# Altium schematic sheet Proc.SchDoc
size Tabloid
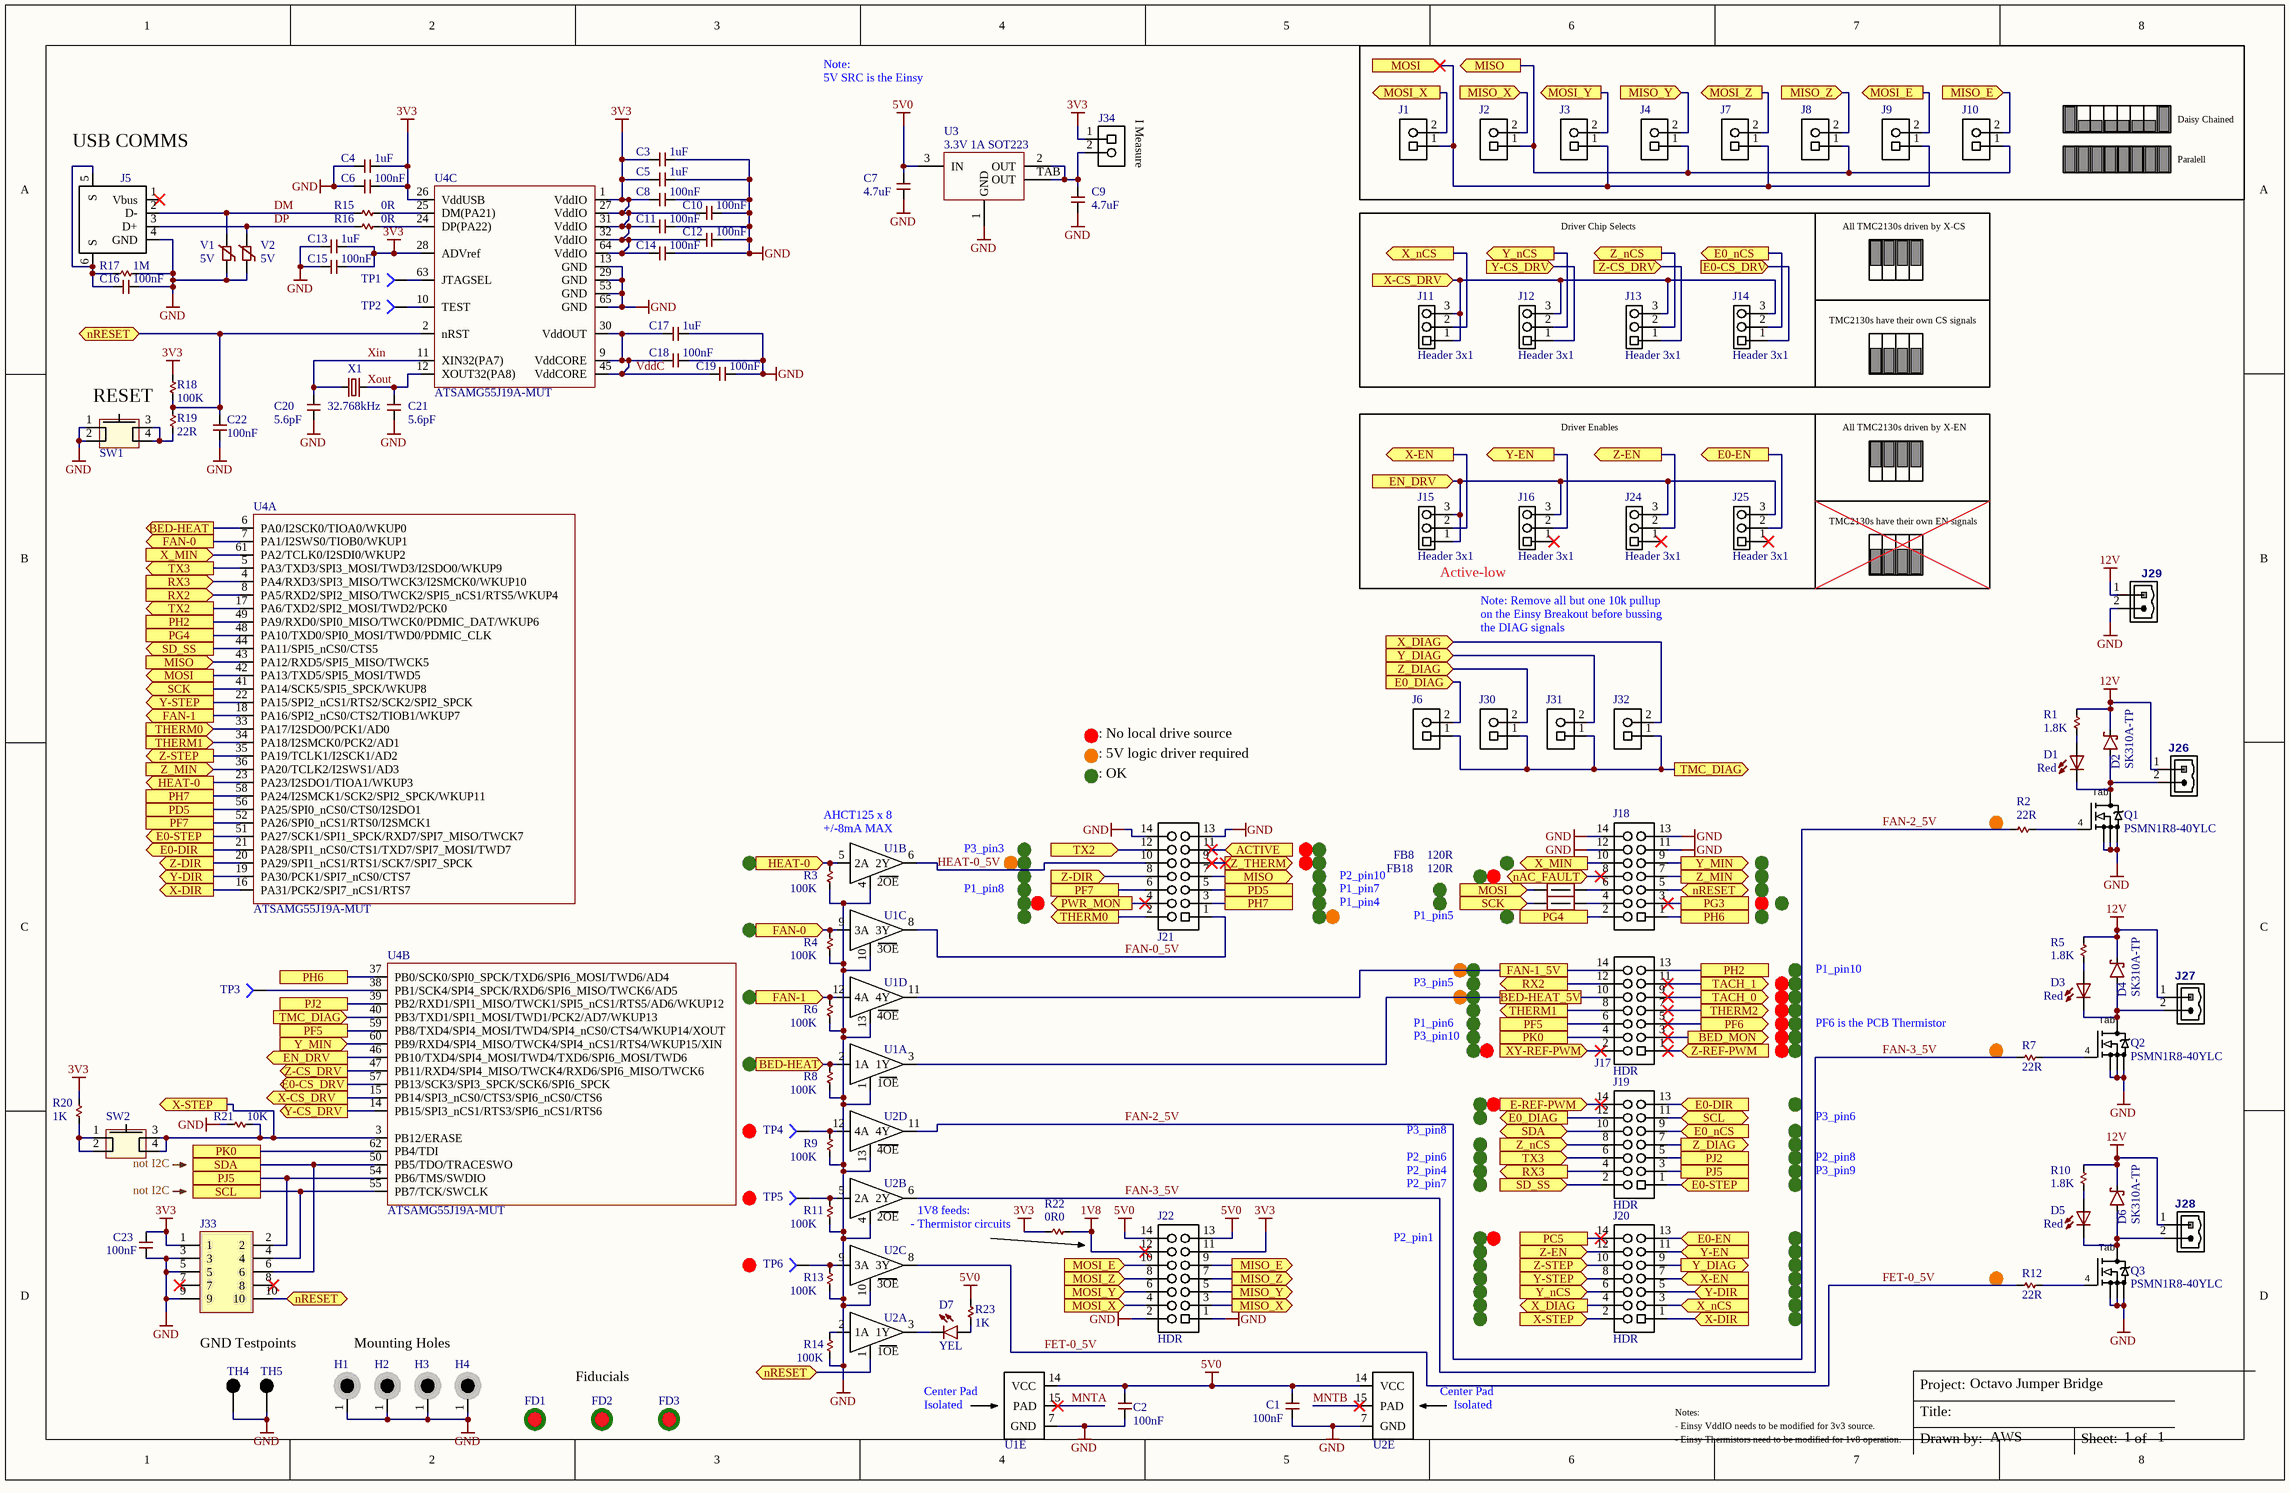
[diagram p0: Proc.SchDoc]

## Parts
C1  100nF  [C0603]
C2  100nF  [C0603]
C3  1uF  [C0402]
C4  1uF  [C0402]
C5  1uF  [C0402]
C6  100nF  [C0402]
C7  value 4.7uF  [C0603]  (hidden comment: 4.7uF 6.3V 0603)
C8  100nF  [C0402]
C9  value 4.7uF  [C0603]  (hidden comment: 4.7uF 6.3V 0603)
C10  100nF  [C0402]
C11  100nF  [C0402]
C12  100nF  [C0402]
C13  1uF  [C0402]
C14  100nF  [C0402]
C15  100nF  [C0402]
C16  100nF  [C0402]
C17  1uF  [C0402]
C18  100nF  [C0402]
C19  100nF  [C0402]
C20  5.6pF  [C0402]
C21  5.6pF  [C0402]
C22  100nF  [C0402]
C23  100nF  [C0402]
D1  Red  [LED2012120]
D2  SK310A-TP  [SMA-SM]
D3  Red  [LED2012120]
D4  SK310A-TP  [SMA-SM]
D5  Red  [LED2012120]
D6  SK310A-TP  [SMA-SM]
D7  YEL  [LED2012120]
FB8  120R  [R0402]
FB18  120R  [R0402]
FD1  FIDUCIAL  [FIDUCIAL-1X2]  (value not drawn)
FD2  FIDUCIAL  [FIDUCIAL-1X2]  (value not drawn)
FD3  FIDUCIAL  [FIDUCIAL-1X2]  (value not drawn)
H1  Hole_DS  [Wave_hole_3x7-doubleSided]  (value not drawn)  (no BOM)
H2  Hole_DS  [Wave_hole_3x7-doubleSided]  (value not drawn)  (no BOM)
H3  Hole_DS  [Wave_hole_3x7-doubleSided]  (value not drawn)  (no BOM)
H4  Hole_DS  [Wave_hole_3x7-doubleSided]  (value not drawn)  (no BOM)
J1  Header 2x1  [HDR2X1]  (value not drawn)
J2  Header 2x1  [HDR2X1]  (value not drawn)
J3  Header 2x1  [HDR2X1]  (value not drawn)
J4  Header 2x1  [HDR2X1]  (value not drawn)
J5  USB-B TH R/A  [PN61729_ALT]  (value not drawn)
J6  Header 2x1  [HDR2X1]  (value not drawn)
J7  Header 2x1  [HDR2X1]  (value not drawn)
J8  Header 2x1  [HDR2X1]  (value not drawn)
J9  Header 2x1  [HDR2X1]  (value not drawn)
J10  Header 2x1  [HDR2X1]  (value not drawn)
J11  Header 3x1  [HDR3X1]
J12  Header 3x1  [HDR3X1]
J13  Header 3x1  [HDR3X1]
J14  Header 3x1  [HDR3X1]
J15  Header 3x1  [HDR3X1]
J16  Header 3x1  [HDR3X1]
J17  HDR  [HDR2X7_ALT_PINOUT]
J18  HDR  [HDR2X7_ALT_PINOUT]  (value not drawn)
J19  HDR  [HDR2X7_ALT_PINOUT]
J20  HDR  [HDR2X7_ALT_PINOUT]
J21  HDR  [HDR2X7_ALT_PINOUT]  (value not drawn)
J22  HDR  [HDR2X7_ALT_PINOUT]
J24  Header 3x1  [HDR3X1]
J25  Header 3x1  [HDR3X1]
J26  0395311002  [MSTBV2]  (value not drawn)
J27  0395311002  [MSTBV2]  (value not drawn)
J28  0395311002  [MSTBV2]  (value not drawn)
J29  0395311002  [MSTBV2]  (value not drawn)
J30  Header 2x1  [HDR2X1]  (value not drawn)
J31  Header 2x1  [HDR2X1]  (value not drawn)
J32  Header 2x1  [HDR2X1]  (value not drawn)
J33  0.05in 2-Row  [FTSH-105-XX-X-DV]  (value not drawn)
J34  Header 2x1  [HDR2X1]  (value not drawn)
Q1  PSMN1R8-40YLC  [SOT669]
Q2  PSMN1R8-40YLC  [SOT669]
Q3  PSMN1R8-40YLC  [SOT669]
R1  1.8K  [R0603]
R2  22R  [R0805]
R3  100K  [R0402]
R4  100K  [R0402]
R5  1.8K  [R0603]
R6  100K  [R0402]
R7  22R  [R0805]
R8  100K  [R0402]
R9  100K  [R0402]
R10  1.8K  [R0603]
R11  100K  [R0402]
R12  22R  [R0805]
R13  100K  [R0402]
R14  100K  [R0402]
R15  0R  [R0402]
R16  0R  [R0402]
R17  1M  [R0402]
R18  100K  [R0402]
R19  22R  [R0805]
R20  1K  [R0402]
R21  10K  [R0402]
R22  0R0  [R0805]
R23  1K  [R0402]
SW1  KMR741NG ULC LFS  [KMR 6 Series]  (value not drawn)
SW2  KMR741NG ULC LFS  [KMR 6 Series]  (value not drawn)
TH4  TH  [TP_80_150]  (value not drawn)  (no BOM)
TH5  TH  [TP_80_150]  (value not drawn)  (no BOM)
TP1  NOTAPART-Testpoint  [TP-2]  (value not drawn)  (no BOM)
TP2  NOTAPART-Testpoint  [TP-2]  (value not drawn)  (no BOM)
TP3  NOTAPART-Testpoint  [TP-2]  (value not drawn)  (no BOM)
TP4  NOTAPART-Testpoint  [TP-2]  (value not drawn)  (no BOM)
TP5  NOTAPART-Testpoint  [TP-2]  (value not drawn)  (no BOM)
TP6  NOTAPART-Testpoint  [TP-2]  (value not drawn)  (no BOM)
U1  SN74AHCT125RGYR  [QFN50P350X350X100_RGY_S-PVQFN-N14]  (value not drawn)  (parts A,B,C,D,E of 5)
U2  SN74AHCT125RGYR  [QFN50P350X350X100_RGY_S-PVQFN-N14]  (value not drawn)  (parts A,B,C,D,E of 5)
U3  3.3V 1A SOT223  [SOT223_AZ1117]
U4  ATSAMG55J19A-MUT  [QFN64_7.5x7.5mm]  (parts A,B,C of 3)
V1  5V  [R0603]
V2  5V  [R0603]
X1  32.768kHz  [XTAL_32X15_2]

## Blocks framed on the sheet
Active-low: J15 J16 J24 J25

## Ports
ACTIVE (in), BED-HEAT (in), BED-HEAT (out), BED-HEAT_5V, BED_MON (out), E0-CS_DRV (in), E0-CS_DRV (out), E0-DIR (in), E0-DIR (out), E0-EN (in), E0-EN (out), E0-STEP (in), E0-STEP (out), E0_DIAG (in), E0_DIAG (out), E0_nCS (in), E0_nCS (out), E-REF-PWM (in), EN_DRV (in), EN_DRV (out), FAN-0 (in), FAN-0 (out), FAN-1 (in), FAN-1 (out), FAN-1_5V, HEAT-0 (in), HEAT-0 (out), MISO (in), MISO (out), MISO_E (in), MISO_E (out), MISO_X (in), MISO_X (out), MISO_Y (in), MISO_Y (out), MISO_Z (in), MISO_Z (out), MOSI (in), MOSI (out), MOSI_E (in), MOSI_E (out), MOSI_X (in), MOSI_X (out), MOSI_Y (in), MOSI_Y (out), MOSI_Z (in), MOSI_Z (out), nAC_FAULT (bidir), nRESET (bidir), PC5, PD5, PF5, PF6 (out), PF7, PG3, PG4, PH2, PH6, PH7, PJ2, PJ5, PK0, PWR_MON (out), RX2 (in), RX2 (out), RX3 (in), RX3 (out), SCK (in), SCK (out), SCL, SCL (bidir), SD_SS (in), SD_SS (out), SDA, SDA (bidir), TACH_0 (out), TACH_1 (out), THERM0 (in), THERM0 (out), THERM1 (in), THERM1 (out), THERM2 (out), TMC_DIAG (in), TMC_DIAG (out), TX2 (in), TX2 (out), TX3 (in), TX3 (out), X-CS_DRV (in), X-CS_DRV (out), X-DIR (in), X-DIR (out), X-EN (in), X-EN (out), X-STEP (in), X-STEP (out), X_DIAG (in), X_DIAG (out), X_MIN (in), X_MIN (out), X_nCS (in), X_nCS (out), XY-REF-PWM (in), Y-CS_DRV (in), Y-CS_DRV (out), Y-DIR (in), Y-DIR (out), Y-EN (in), Y-EN (out), Y-STEP (in), Y-STEP (out), Y_DIAG (in), Y_DIAG (out), Y_MIN (in), Y_MIN (out), Y_nCS (in), Y_nCS (out), Z-CS_DRV (in), Z-CS_DRV (out), Z-DIR (in), Z-DIR (out), Z-EN (in), Z-EN (out), Z-REF-PWM (in), Z-STEP (in), Z-STEP (out), Z_DIAG (in), Z_DIAG (out), Z_MIN (in), Z_MIN (out), Z_nCS (in), Z_nCS (out), Z_THERM (out)

## Nets
1V8: J22.12 R22.2
3V3: C3.2 C4.1 C5.2 C6.2 C8.1 C10.1 C11.1 C12.1 C13.1 C14.1 C15.2 C23.1 J22.11 J33.1 J34.1 R18.2 R20.2 R22.1 U4.1(VddIO) U4.26(VddUSB) U4.27(VddIO) U4.28(ADVref) U4.31(VddIO) U4.32(VddIO) U4.64(VddIO)
5V0: C1.2 C2.2 C7.2 J22.13 J22.14 R23.1 U1.14(VCC) U2.14(VCC) U3.3(IN)
12V: D2.K D4.K D6.K J26.1 J27.1 J28.1 J29.1 R1.2 R5.2 R10.2
GND: C1.1 C2.1 C3.1 C4.2 C5.1 C6.1 C7.1 C8.2 C9.1 C10.2 C11.2 C12.2 C13.2 C14.2 C15.1 C16.1 C17.1 C18.2 C19.2 C20.1 C21.1 C22.1 C23.2 H1.1 H2.1 H3.1 H4.1 J5.4(GND) J18.11 J18.12 J18.13 J18.14 J21.13 J21.14 J22.1 J22.2 J29.2 J33.3 J33.5 J33.9 Q1.1(S) Q1.2(S) Q1.3(S) Q2.1(S) Q2.2(S) Q2.3(S) Q3.1(S) Q3.2(S) Q3.3(S) R3.2 R4.2 R6.2 R8.2 R9.2 R11.2 R13.2 R14.2 R17.1 R21.2 SW1.1 SW1.2 TH4.1 TH5.1 U1.1(1OE) U1.4(2OE) U1.7(GND) U1.10(3OE) U1.13(4OE) U2.4(2OE) U2.7(GND) U2.10(3OE) U2.13(4OE) U3.1(GND) U4.13(GND) U4.29(GND) U4.53(GND) U4.65(GND) V1.2 V2.2
ACTIVE: J21.11 ; port ACTIVE
BED-HEAT: R8.1 U1.2(1A) U4.6(PA0/I2SCK0/TIOA0/WKUP0) ; port BED-HEAT
BED-HEAT_5V: J17.10 U1.3(1Y) ; port BED-HEAT_5V
BED_MON: J17.3 ; port BED_MON
DM: J5.2(D-) R15.1 V1.1
DP: J5.3(D+) R16.1 V2.1
E0-CS_DRV: J14.1 U4.57(PB13/SCK3/SPI3_SPCK/SCK6/SPI6_SPCK) ; port E0-CS_DRV
E0-DIR: J19.13 U4.21(PA28/SPI1_nCS0/CTS1/TXD7/SPI7_MOSI/TWD7) ; port E0-DIR
E0-EN: J20.13 J25.2 ; port E0-EN
E0-STEP: J19.1 U4.51(PA27/SCK1/SPI1_SPCK/RXD7/SPI7_MISO/TWCK7) ; port E0-STEP
E0_DIAG: J6.2 J19.12 ; port E0_DIAG
E0_nCS: J14.2 J19.9 ; port E0_nCS
E-REF-PWM: J19.14 ; port E-REF-PWM
EN_DRV: J15.1 J15.3 J16.3 J24.3 J25.3 U4.46(PB10/TXD4/SPI4_MOSI/TWD4/TXD6/SPI6_MOSI/TWD6) ; port EN_DRV
FAN-0: R4.1 U1.9(3A) U4.7(PA1/I2SWS0/TIOB0/WKUP1) ; port FAN-0
FAN-0_5V: J21.1 U1.8(3Y)
FAN-1: R6.1 U1.12(4A) U4.18(PA16/SPI2_nCS0/CTS2/TIOB1/WKUP7) ; port FAN-1
FAN-1_5V: J17.14 U1.11(4Y) ; port FAN-1_5V
FAN-2_5V: R2.1 U2.11(4Y)
FAN-3_5V: R7.1 U2.6(2Y)
FET-0_5V: R12.1 U2.8(3Y)
HEAT-0: R3.1 U1.5(2A) U4.23(PA23/I2SDO1/TIOA1/WKUP3) ; port HEAT-0
HEAT-0_5V: J21.10 U1.6(2Y)
MISO: J2.1 J4.1 J8.1 J10.1 J21.7 U4.43(PA12/RXD5/SPI5_MISO/TWCK5) ; port MISO
MISO_E: J10.2 J22.9 ; port MISO_E
MISO_X: J2.2 J22.3 ; port MISO_X
MISO_Y: J4.2 J22.5 ; port MISO_Y
MISO_Z: J8.2 J22.7 ; port MISO_Z
MNTA: U1.15(PAD)
MNTB: U2.15(PAD)
MOSI: FB8.2 J1.1 J3.1 J7.1 J9.1 U4.42(PA13/TXD5/SPI5_MOSI/TWD5) ; port MOSI
MOSI_E: J9.2 J22.10 ; port MOSI_E
MOSI_X: J1.2 J22.4 ; port MOSI_X
MOSI_Y: J3.2 J22.6 ; port MOSI_Y
MOSI_Z: J7.2 J22.8 ; port MOSI_Z
nAC_FAULT: J18.8 ; port nAC_FAULT
nRESET: C22.2 J18.5 J33.10 R18.1 R19.2 U2.1(1OE) U4.2(nRST) ; port nRESET
PC5: J20.14 ; port PC5
PD5: J21.5 U4.56(PA25/SPI0_nCS0/CTS0/I2SDO1) ; port PD5
PF5: J17.6 U4.59(PB8/TXD4/SPI4_MOSI/TWD4/SPI4_nCS0/CTS4/WKUP14/XOUT) ; port PF5
PF6: J17.5 ; port PF6
PF7: J21.6 U4.52(PA26/SPI0_nCS1/RTS0/I2SMCK1) ; port PF7
PG3: J18.3 ; port PG3
PG4: J18.2 U4.48(PA10/TXD0/SPI0_MOSI/TWD0/PDMIC_CLK) ; port PG4
PH2: J17.13 U4.49(PA9/RXD0/SPI0_MISO/TWCK0/PDMIC_DAT/WKUP6) ; port PH2
PH6: J18.1 U4.37(PB0/SCK0/SPI0_SPCK/TXD6/SPI6_MOSI/TWD6/AD4) ; port PH6
PH7: J21.3 U4.58(PA24/I2SMCK1/SCK2/SPI2_SPCK/WKUP11) ; port PH7
PJ2: J19.5 U4.39(PB2/RXD1/SPI1_MISO/TWCK1/SPI5_nCS1/RTS5/AD6/WKUP12) ; port PJ2
PJ5: J19.3 J33.2 U4.54(PB6/TMS/SWDIO) ; port PJ5
PK0: J17.4 U4.62(PB4/TDI) ; port PK0
PWR_MON: J21.4 ; port PWR_MON
RX2: J17.12 U4.8(PA5/RXD2/SPI2_MISO/TWCK2/SPI5_nCS1/RTS5/WKUP4) ; port RX2
RX3: J19.4 U4.4(PA4/RXD3/SPI3_MISO/TWCK3/I2SMCK0/WKUP10) ; port RX3
SCK: FB18.2 U4.41(PA14/SCK5/SPI5_SPCK/WKUP8) ; port SCK
SCL: J19.11 J33.4 U4.55(PB7/TCK/SWCLK) ; port SCL
SD_SS: J19.2 U4.44(PA11/SPI5_nCS0/CTS5) ; port SD_SS
SDA: J19.10 J33.6 U4.50(PB5/TDO/TRACESWO) ; port SDA
TACH_0: J17.9 ; port TACH_0
TACH_1: J17.11 ; port TACH_1
THERM0: J21.2 U4.33(PA17/I2SDO0/PCK1/AD0) ; port THERM0
THERM1: J17.8 U4.34(PA18/I2SMCK0/PCK2/AD1) ; port THERM1
THERM2: J17.7 ; port THERM2
TMC_DIAG: J6.1 J30.1 J31.1 J32.1 U4.40(PB3/TXD1/SPI1_MOSI/TWD1/PCK2/AD7/WKUP13) ; port TMC_DIAG
TX2: J21.12 U4.17(PA6/TXD2/SPI2_MOSI/TWD2/PCK0) ; port TX2
TX3: J19.6 U4.5(PA3/TXD3/SPI3_MOSI/TWD3/I2SDO0/WKUP9) ; port TX3
VddC: C17.2 C18.1 C19.1 U4.9(VddCORE) U4.30(VddOUT) U4.45(VddCORE)
X-CS_DRV: J11.1 J11.3 J12.3 J13.3 J14.3 U4.15(PB14/SPI3_nCS0/CTS3/SPI6_nCS0/CTS6) ; port X-CS_DRV
X-DIR: J20.1 U4.16(PA31/PCK2/SPI7_nCS1/RTS7) ; port X-DIR
X-EN: J15.2 J20.7 ; port X-EN
X-STEP: J20.2 R21.1 SW2.3 SW2.4 U4.3(PB12/ERASE) ; port X-STEP
X_DIAG: J20.4 J32.2 ; port X_DIAG
X_MIN: J18.10 U4.61(PA2/TCLK0/I2SDI0/WKUP2) ; port X_MIN
X_nCS: J11.2 J20.3 ; port X_nCS
Xin: C20.2 U4.11(XIN32(PA7)) X1.1(C1)
Xout: C21.2 U4.12(XOUT32(PA8)) X1.2(C2)
XY-REF-PWM: J17.2 ; port XY-REF-PWM
Y-CS_DRV: J12.1 U4.14(PB15/SPI3_nCS1/RTS3/SPI6_nCS1/RTS6) ; port Y-CS_DRV
Y-DIR: J20.5 U4.19(PA30/PCK1/SPI7_nCS0/CTS7) ; port Y-DIR
Y-EN: J16.2 J20.11 ; port Y-EN
Y-STEP: J20.8 U4.22(PA15/SPI2_nCS1/RTS2/SCK2/SPI2_SPCK) ; port Y-STEP
Y_DIAG: J20.9 J31.2 ; port Y_DIAG
Y_MIN: J18.9 U4.60(PB9/RXD4/SPI4_MISO/TWCK4/SPI4_nCS1/RTS4/WKUP15/XIN) ; port Y_MIN
Y_nCS: J12.2 J20.6 ; port Y_nCS
Z-CS_DRV: J13.1 U4.47(PB11/RXD4/SPI4_MISO/TWCK4/RXD6/SPI6_MISO/TWCK6) ; port Z-CS_DRV
Z-DIR: J21.8 U4.20(PA29/SPI1_nCS1/RTS1/SCK7/SPI7_SPCK) ; port Z-DIR
Z-EN: J20.12 J24.2 ; port Z-EN
Z-REF-PWM: J17.1 ; port Z-REF-PWM
Z-STEP: J20.10 U4.35(PA19/TCLK1/I2SCK1/AD2) ; port Z-STEP
Z_DIAG: J19.7 J30.2 ; port Z_DIAG
Z_MIN: J18.7 U4.36(PA20/TCLK2/I2SWS1/AD3) ; port Z_MIN
Z_nCS: J13.2 J19.8 ; port Z_nCS
Z_THERM: J21.9 ; port Z_THERM
NetC9_2: C9.2 J34.2 U3.2(OUT) U3.TAB(OUT)
NetC16_2: C16.2 J5.5(S) J5.6(S) R17.2
NetD1_A: D1.A R1.1
NetD1_C: D1.C D2.A J26.2 Q1.TAB(D)
NetD3_A: D3.A R5.1
NetD3_C: D3.C D4.A J27.2 Q2.TAB(D)
NetD5_A: D5.A R10.1
NetD5_C: D5.C D6.A J28.2 Q3.TAB(D)
NetD7_A: D7.A R23.2
NetD7_C: D7.C U2.3(1Y)
NetFB8_1: FB8.1 J18.6
NetFB18_1: FB18.1 J18.4
NetQ1_4: Q1.4(G) R2.2
NetQ2_4: Q2.4(G) R7.2
NetQ3_4: Q3.4(G) R12.2
NetR9_1: R9.1 TP4.1 U2.12(4A)
NetR11_1: R11.1 TP5.1 U2.5(2A)
NetR13_1: R13.1 TP6.1 U2.9(3A)
NetR14_1: R14.1 U2.2(1A)
NetR15_2: R15.2 U4.25(DM(PA21))
NetR16_2: R16.2 U4.24(DP(PA22))
NetR19_1: R19.1 SW1.3 SW1.4
NetR20_1: R20.1 SW2.1 SW2.2
NetTP1_1: TP1.1 U4.63(JTAGSEL)
NetTP2_1: TP2.1 U4.10(TEST)
NetTP3_1: TP3.1 U4.38(PB1/SCK4/SPI4_SPCK/RXD6/SPI6_MISO/TWCK6/AD5)

Not connected (* = marked no-connect by the designer): J5 1(Vbus)*; J16 1*; J24 1*; J25 1*; J33 7* 8*

## Notes on the sheet
- 5V SRC is the Einsy
- Note:
- (near J5) USB COMMS
- (near J34) I Measure
- Paralell
- Daisy Chained
- Driver Chip Selects
- All TMC2130s driven by X-CS
- TMC2130s have their own CS signals
- RESET
- Driver Enables
- All TMC2130s driven by X-EN
- TMC2130s have their own EN signals
- Note: Remove all but one 10k pullup
- on the Einsy Breakout before bussing
- the DIAG signals
- : 5V logic driver required
- : No local drive source
- +/-8mA MAX
- AHCT125 x 8
- : OK
- P3_pin3
- P1_pin8
- P2_pin10
- P1_pin7
- P1_pin4
- P1_pin5
- P1_pin10
- P1_pin6
- P3_pin5
- PF6 is the PCB Thermistor
- P3_pin10
- (near SW2) not I2C
- P3_pin8
- P2_pin6
- P3_pin6
- P2_pin8
- not I2C
- - Thermistor circuits
- (near U2) 1V8 feeds:
- P2_pin1
- P2_pin4
- P2_pin7
- P3_pin9
- GND Testpoints
- Mounting Holes
- Fiducials
- Center Pad
- Isolated
- Notes:
- - Einsy VddIO needs to be modified for 3v3 source.
- Octavo Jumper Bridge
- - Einsy Thermistors need to be modified for 1v8 operation.
- AWS
- 1
- Title:
- Project:
- Drawn by:
- Sheet:
- of
- (in symbol PSMN1R8-40YLC) Tab

## Library data of the parts
C1 C2 = 100nF 0603 50V X7R: CAP CER 0603 100nF 50V 10% X7R; MANUFACTURER: Kemet; MANUFACTURER #: C0603C104K5RACTU; PART: 100nF 50V X7R 0603; PART DESCRIPTION: 0.10µF ±10% 50V Ceramic Capacitor X7R 0603 (1608 Metric); DISTRIBUTOR #: 399-5089-2-ND; DISTRIBUTOR: Digikey; TOLERANCE: 10%; EE_SPEC: 50V; VALUE: 100nF
C3-C5 C13 C17 = 1uF 0402 6.3V X5R: CAP CER 0402 1uF 6.3V 10% X5R; MANUFACTURER: Murata; MANUFACTURER #: GRM155R60J105KE19D; PART: 1uF 6.3V X5R 0402; PART DESCRIPTION: 1µF ±10% 6.3V Ceramic Capacitor X5R 0402 (1005 Metric); DISTRIBUTOR #: 490-1320-2-ND; DISTRIBUTOR: Digikey; TOLERANCE: 10%; EE_SPEC: 6.3V; VALUE: 1uF
C6 C8 C10-C12 C14-C16 C18 C19 C22 C23 = 100nF 0402 16V X7R: CAP CER 0402 100nF 16V 10% X7R; MANUFACTURER: Murata; MANUFACTURER #: GRM155R71C104KA88D; PART: 0.1uF 16V X7R 0402; PART DESCRIPTION: 0.10µF ±10% 16V Ceramic Capacitor X7R 0402 (1005 Metric); VALUE: 100nF; DISTRIBUTOR #: 490-3261-2-ND; DISTRIBUTOR: Digikey; TOLERANCE: 10%; EE_SPEC: 16V
C7 C9 = 4.7uF 0603 6.3V X7R: CAP CER 4.7UF 6.3V X7R 0603; MANUFACTURER: Samsung; MANUFACTURER #: CL10B475KQ8NQNC; PART DESCRIPTION: 4.7µF ±10% 6.3V Ceramic Capacitor X7R 0603 (1608 Metric); TOLERANCE: 10%; DISTRIBUTOR #: 1276-2087-2-ND; DISTRIBUTOR: Digikey; PART: 4.7uF; EE_SPEC: 6.3V
C20 C21 = 5.6pF 50V 0402 C0G: CAP CER 5.6PF 50V C0G/NP0 0402; MANUFACTURER: Murata; MANUFACTURER #: GRM1555C1H5R6CA01D; PART DESCRIPTION: 5.6pF ±0.25pF 50V Ceramic Capacitor C0G, NP0 0402 (1005 Metric); TOLERANCE: +/-0.25pF; DISTRIBUTOR #: 490-6250-2-ND; DISTRIBUTOR: Digikey; PART: 5.6pF 50V 0402 C0G; EE_SPEC: 50V; VALUE: 5.6pF
D1 D3 D5 = 5988110107F: LED 0805 Red; MANUFACTURER: Dialight; PART: LED Red 0805; PART DESCRIPTION: Red 635nm LED Indication - Discrete 2.2V 0805 (2012 Metric); TOLERANCE: -NA-; EE_SPEC: Vf=2.2V; VALUE: Red; MANUFACTURER #: 5988110107F; DISTRIBUTOR #: 350-2038-2-ND; DISTRIBUTOR: Digikey
D2 D4 D6 = SK310A: DIODE Schottky 3A SMA; MANUFACTURER: MCC; PART: Schottky Diode 100V 3A; PART DESCRIPTION: Diode Schottky 100V 3A Surface Mount DO-214AC (HSMA); TOLERANCE: -NA-; VALUE: -NA-; EE_SPEC: 100V 3A; MANUFACTURER #: SK310A; DISTRIBUTOR #: SK310A-TPTR-ND; DISTRIBUTOR: Digikey
D7 = 5988140107F: LED 0805 Yellow; MANUFACTURER: Dialight; PART: LED Yellow 0805; PART DESCRIPTION: Yellow 593nm LED Indication - Discrete 2V 0805 (2012 Metric); TOLERANCE: -NA-; EE_SPEC: Vf=2V; VALUE: YEL; MANUFACTURER #: 5988140107F; DISTRIBUTOR #: 350-2041-2-ND; DISTRIBUTOR: Digikey
FB8 FB18 = FERRITE 120R 1A 0402: FERRITE BEAD 120 OHM 0402 1LN; MANUFACTURER: Taiyo Yuden; MANUFACTURER #: BKP1005HS121-T; VALUE: 120Rfb; TOLERANCE: -NA-; EE_SPEC: 1A; DISTRIBUTOR #: 587-1921-2-ND; DISTRIBUTOR: Digikey; PART: FERRITE 120R 1A 0402; PART DESCRIPTION: FERRITE BEAD 120 OHM 0402 1LN
FD1-FD3 = FIDUCIAL: MANUFACTURER #: NOTAPART-Fiducial
H1-H4 = Hole_DS: MANUFACTURER #: NOTAPART-Hole
J1-J4 J6-J10 J30-J32 J34 = Header 2x1: Header 2Pin 1Row T-Hole; MANUFACTURER #: 2211S-02G; MANUFACTURER: Multicomp; PART: CONN 2Pin 1Row 0.1"; PART DESCRIPTION: MULTICOMP  2211S-02G  Board-To-Board Connector, 2.54 mm, 2 Contacts, Header, 2211S Series, Through Hole, 1 Rows; TOLERANCE: -NA-; VALUE: JMP; DISTRIBUTOR #: 08N6744; DISTRIBUTOR: Newark; EE_SPEC: -NA-
J5 = USB-B TH R/A: USB connector B PTH; MANUFACTURER: FCI; MANUFACTURER #: 61729-0010BLF; Part Description: USB - B USB 2.0 Receptacle Connector 4 Position Through Hole, Right Angle; EE_SPEC: USB-B T-Hole R/A; Tolerance: NA; DISTRIBUTOR #: 609-1039-ND; DISTRIBUTOR: Digi-Key; PART: USB-B; VALUE: USB-B
J11-J16 J24 J25 = Header 3x1 Male Pin: Header 3Pin 1Row T-Hole; MANUFACTURER #: 2211S-03G; MANUFACTURER: Multicomp; PART: CONN 3Pin 1Row 0.1"; PART DESCRIPTION: MULTICOMP  2211S-03G  Board-To-Board Connector, 2.54 mm, 3 Contacts, Header, 2211S Series, Through Hole, 1 Rows; TOLERANCE: -NA-; VALUE: JMP; DISTRIBUTOR #: 08N6745; DISTRIBUTOR: Newark; EE_SPEC: -NA-
J17-J22 = Header 2X7 Male Pin: CONN HEADER .100" DUAL STR 14POS; MANUFACTURER #: PRPC007DAAN-RC; MANUFACTURER: Sullins; PART DESCRIPTION: 14 Positions Header, Breakaway Connector 0.100" (2.54mm) Through Hole Gold; TOLERANCE: -NA-; DISTRIBUTOR #: S2011EC-07-ND; DISTRIBUTOR: Newark; VALUE: HDR; EE_SPEC: -NA-
J26-J29 = 0395311002: Conn - 5.08mm Pitch Fixed; MANUFACTURER: Molex; PART: 2POS; Part Description: 2 Position Terminal Block Header, Male Pins, Shrouded (4 Side) 0.200" (5.08mm) Vertical Through Hole; EE_SPEC: 300V 15A 0.2"; Tolerance: NA; Value: 0395311002; DISTRIBUTOR #: WM7837-ND; DISTRIBUTOR: Digi-Key; MANUFACTURER #: 0395311002
J33 = ARM Cortex JTAG-DEBUG Header: 20021121-00010C4LF; MANUFACTURER: Amphenol FCI; PART: 10 Pin Conn 2Row SMT; PART DESCRIPTION: 10 Positions Header, Unshrouded Connector 0.050" (1.27mm) Surface Mount Gold; TOLERANCE: -NA-; VALUE: HDR10; MANUFACTURER #: 20021121-00010C4LF; DISTRIBUTOR #: 609-3695-2-ND; DISTRIBUTOR: Digikey; EE_SPEC: -NA-
Q1-Q3 = PSMN1R8-40YLC: MOSFET N-CH 40V 100A LFPAK; MANUFACTURER: Nexperia; MANUFACTURER #: PSMN1R8-40YLC,115; PART: N-FET; PART DESCRIPTION: N-Channel 40V 100A (Tc) 272W (Tc) Surface Mount LFPAK56, Power-SO8; TOLERANCE: -NA-; VALUE: N-FET; EE_SPEC: 40V 100A 1.8mOhm; DISTRIBUTOR #: 1727-1052-2-ND; DISTRIBUTOR: Digikey
R1 R5 R10 = 1.8k 5% 0603: RES 0603 1.8K 100mW 5%; MANUFACTURER: Yageo; MANUFACTURER #: RC0603JR-071K8L; PART DESCRIPTION: 1.8k Ohm ±5% 0.1W, 1/10W Chip Resistor 0603 (1608 Metric) Moisture Resistant Thick Film; EE_SPEC: 1/10W; DISTRIBUTOR #: 311-1.8KGRTR-ND; DISTRIBUTOR: Digikey; PART: 1.8k 5% 0603; TOLERANCE: 5%; VALUE: 1.8K
R2 R7 R12 R19 = 22R 1% 0805: RES SMD 22 OHM 1% 1/8W 0805; MANUFACTURER: Yageo; MANUFACTURER #: RC0805FR-0722RL; Part Description: ±1% 0.125W, 1/8W Chip Resistor 0805 (2012 Metric) Moisture Resistant Thick Film; Tolerance: +/- 1%; DISTRIBUTOR #: 311-22.0CRTR-ND; DISTRIBUTOR: Digi-Key; EE_SPEC: 22R 1% 0805; PART: RES SMD 22 OHM 1% 1/8W 0805; VALUE: 22R
R3 R4 R6 R8 R9 R11 R13 R14 R18 = 100k 1% 0402: RES SMD 100K OHM 1% 1/16W 0402; MANUFACTURER: Samsung; MANUFACTURER #: RC1005F104CS; PART DESCRIPTION: 100k Ohm ±1% 0.063W, 1/16W Chip Resistor 0402 (1005 Metric) Moisture Resistant Thick Film; DISTRIBUTOR #: 1276-3432-1-ND; DISTRIBUTOR: Digikey; PART: 100k 1% 0402; TOLERANCE: 1%; EE_SPEC: 1/16W; VALUE: 100K
R15 R16 = 0R 0402: RES SMD 0.0OHM JUMPER 1/10W 0402; MANUFACTURER: Panasonic; MANUFACTURER #: ERJ-2GE0R00X; PART DESCRIPTION: 0.0 Ohm Jumper 0.1W, 1/10W Chip Resistor 0402 (1005 Metric) Automotive AEC-Q200 Thick Film; MANUFACTURER2 #: RC0402JR-070RL; TOLERANCE: 1%; DISTRIBUTOR #: P0.0JTR-ND; DISTRIBUTOR: Digikey; PART: 0R; EE_SPEC: 1/10W; VALUE: 0R
R17 = 1M 5% 0402: RES 0402 1M 100mW 5%; MANUFACTURER: Panasonic; MANUFACTURER #: ERJ2GEJ105X; PART DESCRIPTION: 1M Ohm ±5% 0.1W, 1/10W Chip Resistor 0402 (1005 Metric) Automotive AEC-Q200 Thick Film; EE_SPEC: 1/10W; DISTRIBUTOR #: P1.0MJTR-ND; DISTRIBUTOR: Digikey; PART: 1M 5% 0402; TOLERANCE: 5%; VALUE: 1M
R20 R23 = RC0402FR-071KL: RES SMD 1K OHM 1% 1/16W 0402; Manufacturer: Yageo; Part Description: 1k Ohm ±1% 0.063W, 1/16W Chip Resistor 0402 (1005 Metric) Moisture Resistant Thick Film; EE_SPEC: 1k 1% 0402; Tolerance: +/- 1%; VALUE: 1K; MANUFACTURER #: RC0402FR-071KL; DISTRIBUTOR #: 311-1.00KLRTR-ND; DISTRIBUTOR: Digi-Key; PART: 1k
R21 = 10k 1% 0402: RES SMD 10K OHM 1% 1/16W 0402; MANUFACTURER: Yageo; MANUFACTURER #: RC0402FR-0710KP; PART DESCRIPTION: 10k Ohm ±1% 0.063W, 1/16W Chip Resistor 0402 (1005 Metric) Moisture Resistant Thick Film; DISTRIBUTOR #: YAG1249TR-ND; DISTRIBUTOR: Digikey; PART: 10k 1% 0402; TOLERANCE: 1%; EE_SPEC: 1/16W; VALUE: 10K
R22 = 0R0 1% 0805: RES 0.0 OHM 1/8W JUMP 0805 SMD; MANUFACTURER: STACKPOLE; MANUFACTURER #: RMCF0805ZT0R00; PART DESCRIPTION: 0 Ohms Jumper 0.125W, 1/8W Chip Resistor 0805 (2012 Metric) Automotive AEC-Q200 Thick Film; TOLERANCE: 1%; EE_SPEC: 0.125W; PART: 0R0; DISTRIBUTOR: Digi-Key; DISTRIBUTOR #: RMCF0805ZT0R00CT-ND; VALUE: 0R0
SW1 SW2 = KMR741NG ULC LFS: SWITCH TACTILE SPST-NO 0.05A 12V; MANUFACTURER: C&K; PART: Tactile Pushbutton SMT; PART DESCRIPTION: Tactile Switch SPST-NO Top Actuated Surface Mount; TOLERANCE: -NA-; VALUE: -NA-; EE_SPEC: 32V 50mA; MANUFACTURER #: KMR741NG ULC LFS; DISTRIBUTOR #: CKN10688TR-ND; DISTRIBUTOR: Digikey
TH4 TH5 = TH 85mil: THRUHOLE 85mil; PART: THRUHOLE; COST: NA
TP1-TP6 = Testpoint SMT: MANUFACTURER #: NOTAPART-Testpoint
U1 U2 = SN74AHCT125: Quadruple Bus Buffer Gates With 3-State Outputs 14-VQFN -40 to 125; MANUFACTURER: Texas Instruments; PART: IC BUS BUFFER TRI-ST QD 14VQFN; PART DESCRIPTION: Buffer, Non-Inverting 4 Element 1 Bit per Element Push-Pull Output 14-VQFN (3.5x3.5); TOLERANCE: -NA-; VALUE: Tri-State Buffer; EE_SPEC: 5V 8mA; MANUFACTURER #: SN74AHCT125RGYR; DISTRIBUTOR #: 296-13910-2-ND; DISTRIBUTOR: Digikey
U3 = LDO 3.3V 1A SOT223: IC REG LDO 3.3V 1A SOT223; MANUFACTURER #: AZ1117EH-3.3TRG1; MANUFACTURER: Diodes Inc; PART DESCRIPTION: Linear Voltage Regulator IC Positive Fixed Output 3.3V 1A SOT-223; TOLERANCE: -NA-; VALUE: 3.3V LDO; DISTRIBUTOR #: AZ1117EH-3.3TRG1DITR-ND; DISTRIBUTOR: Digikey; PART: IC REG LDO 3.3V 1A SOT223; EE_SPEC: 1A
U4 = ATSAMG55J19A-MUT: IC MCU 32BIT 512KB FLASH 64QFN; MANUFACTURER: Atmel; PART DESCRIPTION: ARM® Cortex®-M4 SAM G55 Microcontroller IC 32-Bit 120MHz 512KB (512K x 8) FLASH 64-QFN (7.5x7.5); TOLERANCE: -NA-; VALUE: -NA-; EE_SPEC: 3.3V; MANUFACTURER #: ATSAMG55J19A-MUT; DISTRIBUTOR #: ATSAMG55J19A-MUT-ND; DISTRIBUTOR: Digikey; PART: ATSAMG55J19A-MUT
V1 V2 = VAR 5V 0603: VAR 0603 5V 0.5Pf; MANUFACTURER: YAGEO; MANUFACTURER #: CG0603MLC-05E; PART: 5VDC; EE_SPEC: 5VDC 0.5pF; Tolerance: NA; DISTRIBUTOR #: CG0603MLC-05ETR-ND; DISTRIBUTOR: Digi-Key; Part Description: VARISTOR 0603; VALUE: 5V
X1 = 32.768kHz 20ppm 7pF 50k_ESR: CRYSTAL 32.768KHZ 7PF SMD; MANUFACTURER: ECS; MANUFACTURER #: ECS-.327-7-34R-TR; PART DESCRIPTION: 32.768kHz ±20ppm Crystal 7pF 50 kOhm -40°C ~ 85°C Surface Mount 2-SMD, No Lead; TOLERANCE: 20ppm; DISTRIBUTOR #: XC2126TR-ND; DISTRIBUTOR: Digikey; PART: 32.768kHz; EE_SPEC: 32.768kHz 20ppm 7pF 50k_ESR; VALUE: 32.768kHz